# Altium schematic sheet ZHSD-USB-UART.SchDoc
size A4; DrawnBy: UGUR KELES; DocumentNumber: 12; SheetNumber: 11; SheetTotal: 16; Size: A4
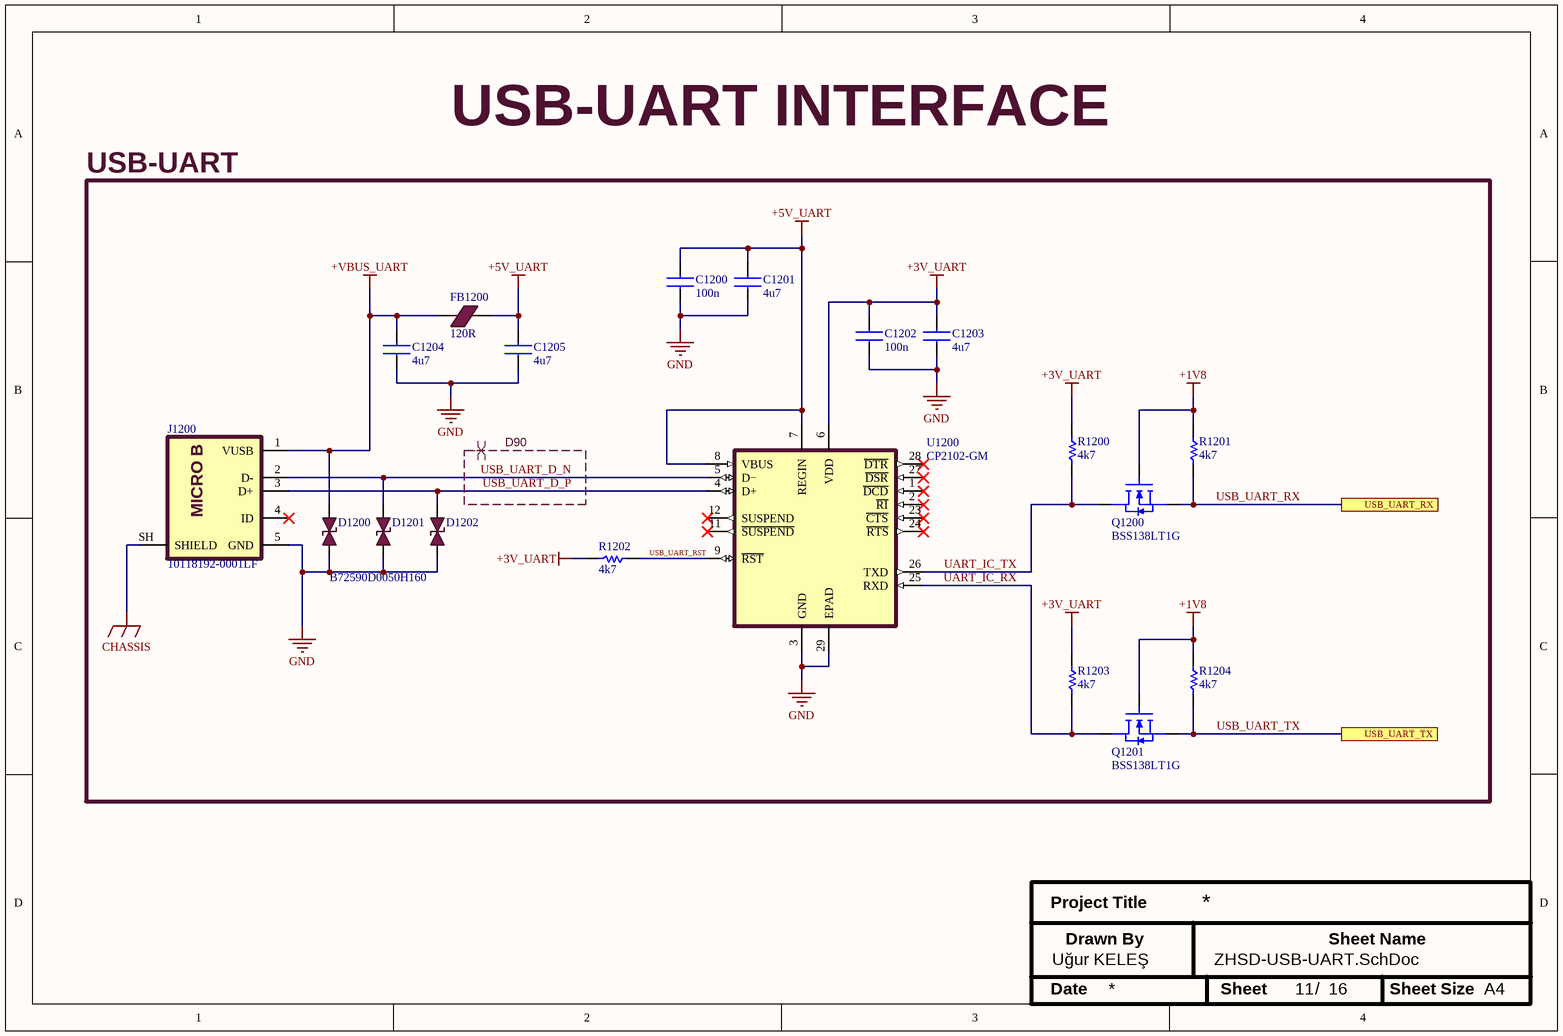
[diagram p0: ZHSD-USB-UART.SchDoc]

## Parts
C1200  100n  [0603CAPC1608X09N]
C1201  4u7  [0603CAPC1608X09N]
C1202  100n  [0603CAPC1608X09N]
C1203  4u7  [0603CAPC1608X09N]
C1204  4u7  [0603CAPC1608X09N]
C1205  4u7  [0603CAPC1608X09N]
D1200  B72590D0050H160  [0402DIOC1005X06N]
D1201  B72590D0050H160  [0402DIOC1005X06N]  (value not drawn)
D1202  B72590D0050H160  [0402DIOC1005X06N]  (value not drawn)
FB1200  120R  [0603INDC1608X08N]
J1200  10118192-0001LF  [USB2.0 MICRO B SMD]
Q1200  BSS138LT1G  [SOT95P237X89-3N]
Q1201  BSS138LT1G  [SOT95P237X89-3N]
R1200  4k7  [0402RESC1005X04N]
R1201  4k7  [0402RESC1005X04N]
R1202  4k7  [0402RESC1005X04N]
R1203  4k7  [0402RESC1005X04N]
R1204  4k7  [0402RESC1005X04N]
U1200  CP2102-GM  [QFN50P500X500X100_HS-29N]

## Blocks framed on the sheet
USB-UART: C1200-C1205 D1200-D1202 FB1200 J1200 Q1200 Q1201 R1200-R1204 U1200

## Ports
USB_UART_RX (see ZHSD-Block[3600,4400], ZHSD-ZYNQ-MIO[3700,1600]), USB_UART_TX (see ZHSD-Block[3600,4600], ZHSD-ZYNQ-MIO[3700,1700])

## Nets
+1V8: Q1200.1(G) Q1201.1(G) R1201.1 R1204.1
+3V_UART: C1202.2 C1203.2 R1200.1 R1202.2 R1203.1 U1200.6(VDD)
+5V_UART: C1200.2 C1201.2 C1205.2 FB1200.2 U1200.7(REGIN) U1200.8(VBUS)
+VBUS_UART: C1204.2 D1200.2 FB1200.1 J1200.1(VUSB)
CHASSIS: J1200.SH(SHIELD)
GND: C1200.1 C1201.1 C1202.1 C1203.1 C1204.1 C1205.1 D1200.1 D1201.1 D1202.1 J1200.5(GND) U1200.3(GND) U1200.29(EPAD)
UART_IC_RX: Q1201.3(D) R1203.2 U1200.25(RXD)
UART_IC_TX: Q1200.3(D) R1200.2 U1200.26(TXD)
USB_UART_D_N: D1201.2 J1200.2(D-) U1200.5(D−)
USB_UART_D_P: D1202.2 J1200.3(D+) U1200.4(D+)
USB_UART_RST: R1202.1 U1200.9(~{RST})
USB_UART_RX: Q1200.2(S) R1201.2 ; port USB_UART_RX
USB_UART_TX: Q1201.2(S) R1204.2 ; port USB_UART_TX

Not connected (* = marked no-connect by the designer): J1200 4(ID)*; U1200 1(~{DCD})* 2(~{RI})* 11(~{SUSPEND})* 12(SUSPEND)* 23(~{CTS})* 24(~{RTS})* 27(~{DSR})* 28(~{DTR})*

## Layout directives
differential pair; differential pair class USB; rule Differential Pairs Routing [Pref Gap = 6.299mil    Min Gap  = 5mil    Max Gap  = 7.874milPref Width = 3.937mil    Min Width  = 3.937mil    Max Width  = 4.768mil]; Impedance: D90: USB_UART_D_N, USB_UART_D_P

## Notes on the sheet
- USB-UART INTERFACE
- Project Title
- Uğur KELEŞ
- Drawn By
- Sheet Name
- Date
- Sheet
- /
- Sheet Size
- A4
- (in symbol USB-MICRO-B) MICRO B

## Library data of the parts
C1200 C1202 = GRM155R71C104KA88J: CAP CER 0.1UF 16V X7R 0402 (1005) ±10%; Manufacturer: Murata Electronics; Value: 0.1 µF; ComponentLink1Description: Datasheet; ComponentLink1URL: https://search.murata.co.jp/Ceramy/image/img/A01X/G101/ENG/GRM155R71C104KA88-01.pdf; MPN: GRM155R71C104KA88J; Package: 0402; Tolerance: ±10%; Voltage: 16V
C1201 C1203-C1205 = CL10A475KP8NNNC: CAP CER 4.7UF 10V X5R 0603 (1608) ±10%; Manufacturer: Samsung Electro-Mechanics; Value: 4.7 µF; ComponentLink1Description: Datasheet; ComponentLink1URL: https://mm.digikey.com/Volume0/opasdata/d220001/medias/docus/609/CL10A475KP8NNNC_Spec.pdf; MPN: CL10A475KP8NNNC; Package: 0603; Tolerance: ±10%; Voltage: 10V
D1200-D1202 = B72590D0050H160: Varistor 1 Circuit Surface Mount, MLCV 0402 (1005 Metric); Manufacturer: EPCOS - TDK Electronics; ComponentLink1Description: Datasheet; ComponentLink1URL: https://www.tdk-electronics.tdk.com/inf/75/ds/High_speed_series.pdf?ref_disty=digikey; MPN: B72590D0050H160; Package: 0402
FB1200 = BLM18SG121TN1D: FERRITE BEAD 120 OHM 0603 (1608) 3A 25mOhm; Manufacturer: Murata Electronics; Impedance @ Frequency: 120 Ohms @ 100 MHz; ComponentLink1Description: Datasheet; ComponentLink1URL: https://pim.murata.com/asset/pim4/ferriteBeadInductortypefilter/ENFA0003_PDF_FERRITEBEADINDUCTORTYPEFILTER?lastModifiedDatetime=20250707190934; ComponentLink2Description: Website; ComponentLink2URL: https://pim.murata.com/en-global/pim/details/?partNum=BLM18SG121TN1%23; Current Rating (Max): 3A; DC Resistance (DCR) (Max): 25mOhm; MPN: BLM18SG121TN1D; Package: 0603
J1200 = USB-MICRO-B: CONN RCPT USB2.0 MICRO B SMD R/A; Manufacturer: Amphenol ICC (FCI); ComponentLink1Description: Datasheet; ComponentLink1URL: https://cdn.amphenol-cs.com/media/wysiwyg/files/documentation/datasheet/inputoutput/io_usb_micro.pdf; MPN: 10118192-0001LF
Q1200 Q1201 = BSS138LT1G: N-Channel 50 V 200mA (Ta) 225mW (Ta) Surface Mount SOT-23-3 (TO-236); Manufacturer: onsemi; Drain to Source Voltage (Vdss): 50 V; Rds On (Max) @ Id, Vgs: 3.5Ohm @ 200mA, 5V; Vgs (Max): ±20V; ComponentLink1Description: Datasheet; ComponentLink1URL: https://www.onsemi.com/pdf/datasheet/bss138lt1-d.pdf; MPN: BSS138LT1G; Package: SOT-23-3
R1200-R1204 = RC0402JR-074K7L: RES 4.7K OHM 5% 1/16W 0402 (1005); Manufacturer: YAGEO; MPN: RT0402FRE0780RL; Value: 4.7 kOhms; Voltage: 50V; ComponentLink1Description: Datasheet; ComponentLink1URL: https://yageogroup.com/content/datasheet/asset/file/PYU-RC_GROUP_51_ROHS_L; Tolerance: ±5%; Package: 0402
U1200 = CP2102-GM: USB Bridge, USB to UART USB 2.0 UART Interface 28-QFN (5x5); Manufacturer: Silicon Labs; ComponentLink1Description: Datasheet; ComponentLink1URL: https://www.silabs.com/documents/public/data-sheets/CP2102-9.pdf; MPN: CP2102-GM